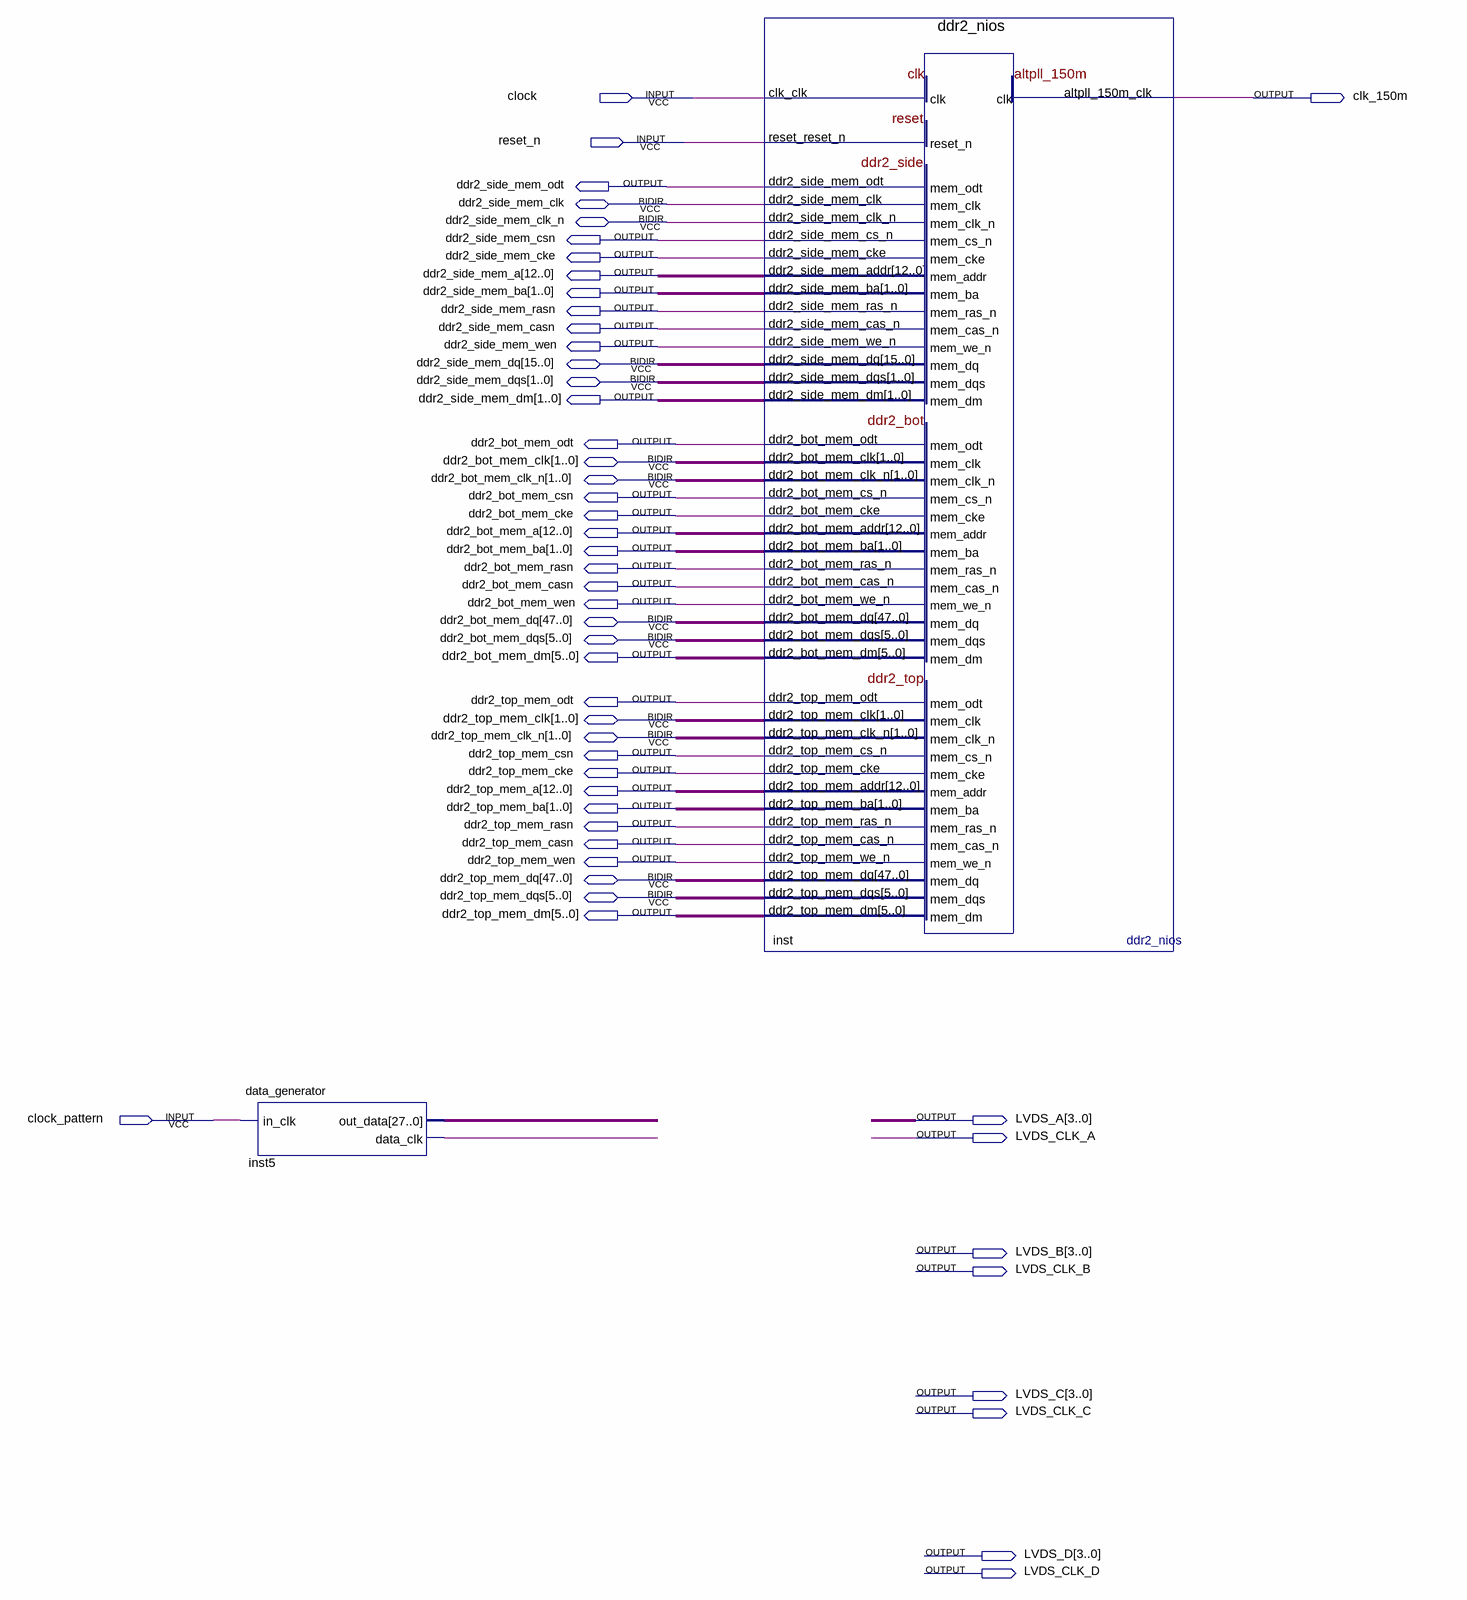
[diagram p0: schematic sheet]
// Quartus schematic EP4C115_DDR2.bdf as structural Verilog: 2 symbols, 51 pins
module EP4C115_DDR2 (
  input  clock,
  input  reset_n,
  input  clock_pattern,
  inout  ddr2_side_mem_clk,
  inout  ddr2_side_mem_clk_n,
  inout  [15:0] ddr2_side_mem_dq,
  inout  [1:0] ddr2_side_mem_dqs,
  inout  [1:0] ddr2_bot_mem_clk,
  inout  [1:0] ddr2_bot_mem_clk_n,
  inout  [47:0] ddr2_bot_mem_dq,
  inout  [5:0] ddr2_bot_mem_dqs,
  inout  [1:0] ddr2_top_mem_clk,
  inout  [1:0] ddr2_top_mem_clk_n,
  inout  [47:0] ddr2_top_mem_dq,
  inout  [5:0] ddr2_top_mem_dqs,
  output clk_150m,
  output ddr2_side_mem_odt,
  output ddr2_side_mem_csn,
  output ddr2_side_mem_cke,
  output [12:0] ddr2_side_mem_a,
  output [1:0] ddr2_side_mem_ba,
  output ddr2_side_mem_rasn,
  output ddr2_side_mem_casn,
  output ddr2_side_mem_wen,
  output [1:0] ddr2_side_mem_dm,
  output ddr2_bot_mem_odt,
  output ddr2_bot_mem_csn,
  output ddr2_bot_mem_cke,
  output [12:0] ddr2_bot_mem_a,
  output [1:0] ddr2_bot_mem_ba,
  output ddr2_bot_mem_rasn,
  output ddr2_bot_mem_casn,
  output ddr2_bot_mem_wen,
  output [5:0] ddr2_bot_mem_dm,
  output ddr2_top_mem_odt,
  output ddr2_top_mem_csn,
  output ddr2_top_mem_cke,
  output [12:0] ddr2_top_mem_a,
  output [1:0] ddr2_top_mem_ba,
  output ddr2_top_mem_rasn,
  output ddr2_top_mem_casn,
  output ddr2_top_mem_wen,
  output [5:0] ddr2_top_mem_dm,
  output [3:0] LVDS_A,
  output LVDS_CLK_A,
  output [3:0] LVDS_B,
  output LVDS_CLK_B,
  output [3:0] LVDS_C,
  output LVDS_CLK_C,
  output [3:0] LVDS_D,
  output LVDS_CLK_D
);

  wire inst5_data_clk;
  wire [27:0] inst5_out_data;

  data_generator inst5 (.in_clk(clock_pattern), .out_data(inst5_out_data), .data_clk(inst5_data_clk));
  ddr2_nios inst (
    .clk_clk(clock), .reset_reset_n(reset_n), .ddr2_side_mem_odt(ddr2_side_mem_odt),
    .ddr2_side_mem_cs_n(ddr2_side_mem_csn), .ddr2_side_mem_cke(ddr2_side_mem_cke),
    .ddr2_side_mem_addr(ddr2_side_mem_a), .ddr2_side_mem_ba(ddr2_side_mem_ba),
    .ddr2_side_mem_ras_n(ddr2_side_mem_rasn), .ddr2_side_mem_cas_n(ddr2_side_mem_casn),
    .ddr2_side_mem_we_n(ddr2_side_mem_wen), .ddr2_side_mem_dm(ddr2_side_mem_dm), .altpll_150m_clk(clk_150m),
    .ddr2_bot_mem_odt(ddr2_bot_mem_odt), .ddr2_bot_mem_cs_n(ddr2_bot_mem_csn),
    .ddr2_bot_mem_cke(ddr2_bot_mem_cke), .ddr2_bot_mem_addr(ddr2_bot_mem_a),
    .ddr2_bot_mem_ba(ddr2_bot_mem_ba), .ddr2_bot_mem_ras_n(ddr2_bot_mem_rasn),
    .ddr2_bot_mem_cas_n(ddr2_bot_mem_casn), .ddr2_bot_mem_we_n(ddr2_bot_mem_wen),
    .ddr2_bot_mem_dm(ddr2_bot_mem_dm), .ddr2_top_mem_odt(ddr2_top_mem_odt),
    .ddr2_top_mem_cs_n(ddr2_top_mem_csn), .ddr2_top_mem_cke(ddr2_top_mem_cke),
    .ddr2_top_mem_addr(ddr2_top_mem_a), .ddr2_top_mem_ba(ddr2_top_mem_ba),
    .ddr2_top_mem_ras_n(ddr2_top_mem_rasn), .ddr2_top_mem_cas_n(ddr2_top_mem_casn),
    .ddr2_top_mem_we_n(ddr2_top_mem_wen), .ddr2_top_mem_dm(ddr2_top_mem_dm),
    .ddr2_side_mem_clk(ddr2_side_mem_clk), .ddr2_side_mem_clk_n(ddr2_side_mem_clk_n),
    .ddr2_side_mem_dq(ddr2_side_mem_dq), .ddr2_side_mem_dqs(ddr2_side_mem_dqs),
    .ddr2_bot_mem_clk(ddr2_bot_mem_clk), .ddr2_bot_mem_clk_n(ddr2_bot_mem_clk_n),
    .ddr2_bot_mem_dq(ddr2_bot_mem_dq), .ddr2_bot_mem_dqs(ddr2_bot_mem_dqs),
    .ddr2_top_mem_clk(ddr2_top_mem_clk), .ddr2_top_mem_clk_n(ddr2_top_mem_clk_n),
    .ddr2_top_mem_dq(ddr2_top_mem_dq), .ddr2_top_mem_dqs(ddr2_top_mem_dqs));
endmodule
